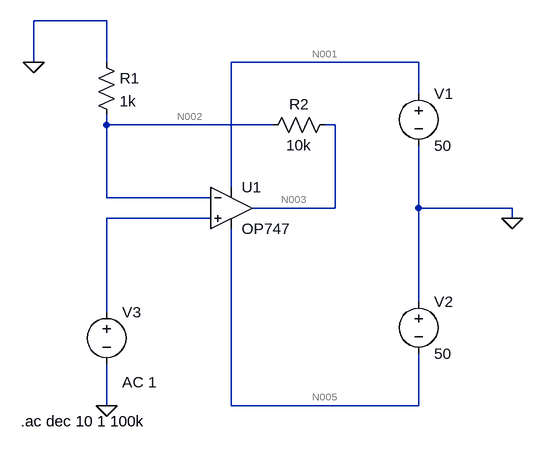
[diagram p0: schematic 3_Zadatak_Lab5.asc]
3_Zadatak_Lab5.asc, the LTspice schematic file:
Version 4
SHEET 1 880 680
WIRE 0 -160 -112 -160
WIRE -112 -96 -112 -160
WIRE 0 -96 0 -160
WIRE 480 -96 192 -96
WIRE 480 -48 480 -96
WIRE 0 0 0 -16
WIRE 256 0 0 0
WIRE 352 0 336 0
WIRE 192 96 192 -96
WIRE 0 112 0 0
WIRE 160 112 0 112
WIRE 352 128 352 0
WIRE 352 128 224 128
WIRE 480 128 480 32
WIRE 624 128 480 128
WIRE 160 144 0 144
WIRE 624 144 624 128
WIRE 480 272 480 128
WIRE 0 288 0 144
WIRE 0 432 0 368
WIRE 192 432 192 160
WIRE 480 432 480 352
WIRE 480 432 192 432
FLAG 0 432 0
FLAG -112 -96 0
FLAG 624 144 0
SYMBOL OpAmps\\OP747 192 64 R0
SYMATTR InstName U1
SYMBOL voltage 480 -64 R0
SYMATTR InstName V1
SYMATTR Value 50
SYMBOL voltage 480 256 R0
SYMATTR InstName V2
SYMATTR Value 50
SYMBOL voltage 0 272 R0
WINDOW 123 24 124 Left 2
WINDOW 39 0 0 Left 0
SYMATTR InstName V3
SYMATTR Value ""
SYMATTR Value2 AC 1
SYMBOL res -16 -112 R0
SYMATTR InstName R1
SYMATTR Value 1k
SYMBOL res 352 -16 R90
WINDOW 0 0 56 VBottom 2
WINDOW 3 32 56 VTop 2
SYMATTR InstName R2
SYMATTR Value 10k
TEXT -132 456 Left 2 !.ac dec 10 1 100k

The netlist it stands for:
* 3_Zadatak_Lab5.asc
XU1 N004 N002 N001 N005 N003 OP747  ; pins In+ In- V+ V- OUT
V1 N001 0 50
V2 0 N005 50
V3 N004 0 AC 1
R1 0 N002 1k
R2 N003 N002 10k
.ac dec 10 1 100k
.backanno
.end

* Results of the author's LTspice run, read from the files saved beside the schematic
* Operating Point, zero values left out:
*   V(n002) = 80 µV
*   V(n005) = -50 V
*   V(n001) = 50 V
*   V(n003) = 811 µV
*   I(R2) = 73.1 nA
*   I(R1) = -80 nA
*   I(V3) = 8.901 nA
*   I(V2) = -609.8 µA
*   I(V1) = -609.9 µA
*   Ix(u1:1) = -8.901 nA
*   Ix(u1:2) = -6.901 nA
*   Ix(u1:99) = 609.9 µA
*   Ix(u1:50) = -609.8 µA
*   Ix(u1:45) = -73.1 nA
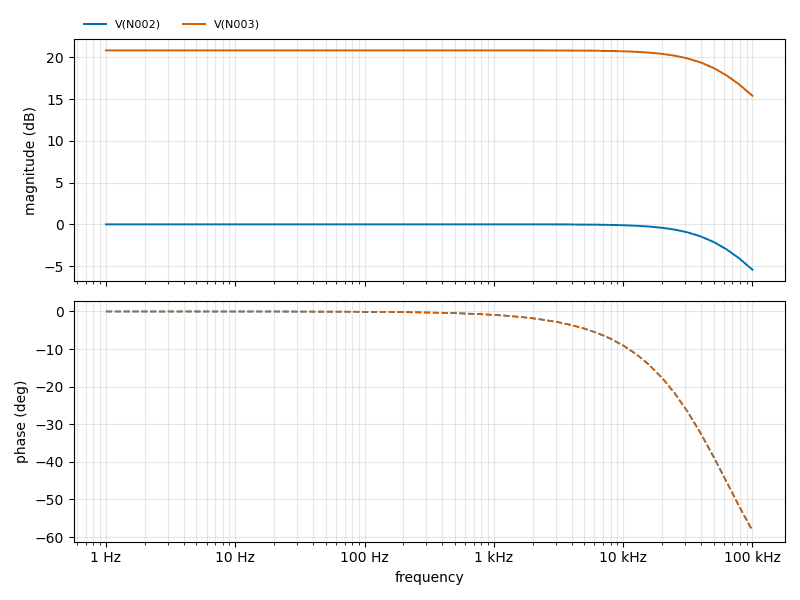
[diagram p1: AC Analysis of 3_Zadatak_Lab5.asc, plotted from the saved traces]
* AC Analysis, 1 run:
*   V(N002): -0.00 dB at 1 Hz, -5.43 dB at 100 kHz, peak -0.00 dB at 1 Hz, 3 dB below the peak at 63.33 kHz
*   V(N003): 20.83 dB at 1 Hz, 15.40 dB at 100 kHz, peak 20.83 dB at 1 Hz, 3 dB below the peak at 63.33 kHz